# Altium project sigcarrier.PrjPcb (part 2 of 2)
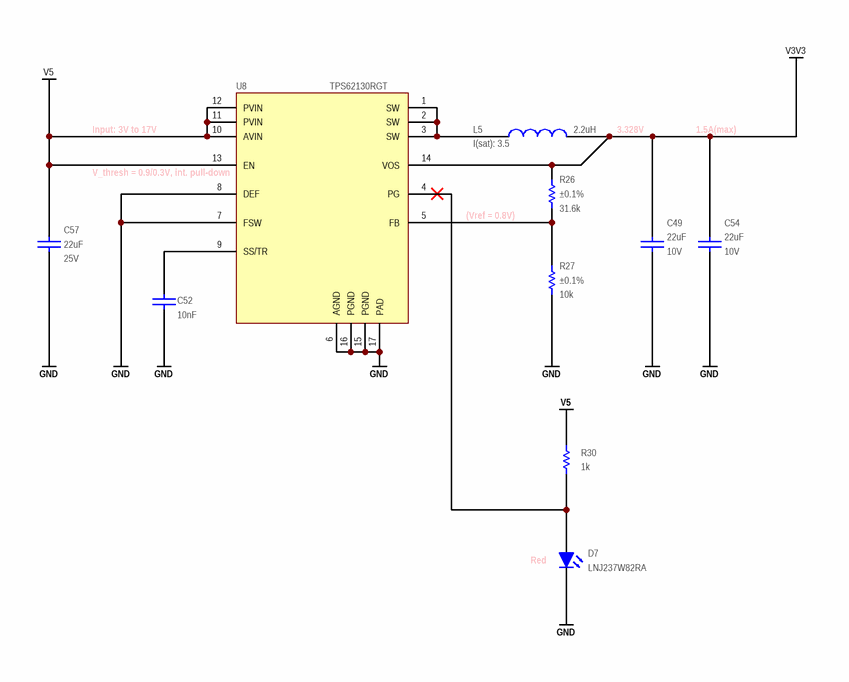
[diagram p17: 05_power.SchDoc]

## Nets that join several sheets
GND: 01_main (51 pins), 03_cellular (66 pins), 02_som (84 pins), 04_ethernet (42 pins), 05_power (12 pins)
V3V3: 01_main (R1.2 R3.2 U12.5), 03_cellular (13 pins), 04_ethernet (13 pins), 05_power (5 pins)
V5: 01_main (10 pins), 03_cellular (U3.1 U3.3 U3.4), 02_som (20 pins), 05_power (6 pins)
VCC3P3_SYS: 01_main (5 pins), 02_som (U1.PAK17 U1.PAK18 U1.PAL17 U1.PAL18)
XUSB3_VBUS: 01_main (6 pins), 02_som (U1.PD42 U1.PD43)
MDI0_N: 01_main (P5.7), 04_ethernet (T1.14)
MDI0_P: 01_main (P5.8), 04_ethernet (T1.13)
MDI1_N: 01_main (P5.5), 04_ethernet (T1.17)
MDI1_P: 01_main (P5.6), 04_ethernet (T1.16)
MDI2_N: 01_main (P5.3), 04_ethernet (T1.20)
MDI2_P: 01_main (P5.4), 04_ethernet (T1.19)
MDI3_N: 01_main (P5.1), 04_ethernet (T1.23)
MDI3_P: 01_main (P5.2), 04_ethernet (T1.22)
SIMCLK: 01_main (C31.1 P9.C3), 03_cellular (U2.A6)
SIMIN: 01_main (P9.DETECT_SWITCH R25.1), 03_cellular (U2.A4)
SIMIO: 01_main (C32.1 P9.C7), 03_cellular (U2.A5)
SIMRST: 01_main (C30.1 P9.C2), 03_cellular (U2.A7)
SIMVCC: 01_main (C28.2 C29.1 P9.C1 R25.2), 03_cellular (U2.A3)
XBOOT_CONFIG0: 01_main (J1.10), 02_som (U1.PAK32)
XBOOT_CONFIG1: 01_main (J1.8), 02_som (U1.PAL32)
XBOOT_CONFIG2: 01_main (J1.6), 02_som (U1.PAK31)
XBOOT_CONFIG3: 01_main (J1.4), 02_som (U1.PAL31)
XDEBUG_RXD: 01_main (R62.2 U12.4), 02_som (U1.PAL22)
XDEBUG_TXD: 01_main (R63.2 U12.6), 02_som (U1.PAK22)
XETHPHY_INT: 02_som (U1.PB42), 04_ethernet (R42.1 U11.20)
XETHPHY_RST: 02_som (U1.PA42), 04_ethernet (R53.1 U11.29)
XGMAC_MDC: 02_som (U1.PB4), 04_ethernet (R52.1)
XGMAC_MDIO: 02_som (U1.PB8), 04_ethernet (R51.1 R56.2)
XGMAC_RXCLK: 02_som (U1.PB5), 04_ethernet (R41.1)
XGMAC_RXCTL: 02_som (U1.PA6), 04_ethernet (R31.1)
XGMAC_RXD0: 02_som (U1.PA8), 04_ethernet (R33.1)
XGMAC_RXD1: 02_som (U1.PB7), 04_ethernet (R34.1)
XGMAC_RXD2: 02_som (U1.PA7), 04_ethernet (R35.1)
XGMAC_RXD3: 02_som (U1.PB6), 04_ethernet (R40.1)
XGMAC_TXCLK: 02_som (U1.PA5), 04_ethernet (R50.1)
XGMAC_TXCTL: 02_som (U1.PA1), 04_ethernet (R45.1)
XGMAC_TXD0: 02_som (U1.PB2), 04_ethernet (R49.1)
XGMAC_TXD1: 02_som (U1.PA2), 04_ethernet (R48.1)
XGMAC_TXD2: 02_som (U1.PB3), 04_ethernet (R47.1)
XGMAC_TXD3: 02_som (U1.PA3), 04_ethernet (R46.1)
XHSIC_HUB_SCL: 03_cellular (R29.1), 02_som (U1.PAK24)
XHSIC_HUB_SDA: 03_cellular (R28.1), 02_som (U1.PAL24)
XLCD2_GPIO1: 01_main (Q1.1 R6.1), 02_som (U1.PAK33)
XLCD_GPIO: 03_cellular (R19.2), 02_som (U1.PAK34)
XPWR_KEY: 01_main (R2.2), 02_som (U1.PAF1)
XRESET: 01_main (R4.2), 02_som (U1.PAG1)
XUART0_RX: 01_main (R58.2 R60.1 U12.3), 02_som (U1.PAL23)
XUART0_TX: 01_main (R57.2 R61.1 U12.1), 02_som (U1.PAK23)
XUHOST1_D_N: 03_cellular (U2.C15), 02_som (U1.PA36)
XUHOST1_D_P: 03_cellular (U2.B15), 02_som (U1.PB36)
XUHOST_VBUSCTRL: 03_cellular (R59.2), 02_som (U1.PB41)
XUSB3_D_N: 01_main (P8.2 U5.1), 02_som (U1.PA35)
XUSB3_D_P: 01_main (P8.3 U5.3), 02_som (U1.PB35)
XUSB3_ID: 01_main (D6.2 R18.1 SL1.2), 02_som (U1.PB37)
XUSB3_VBUSCTRL: 01_main (R21.2), 02_som (U1.PA41)